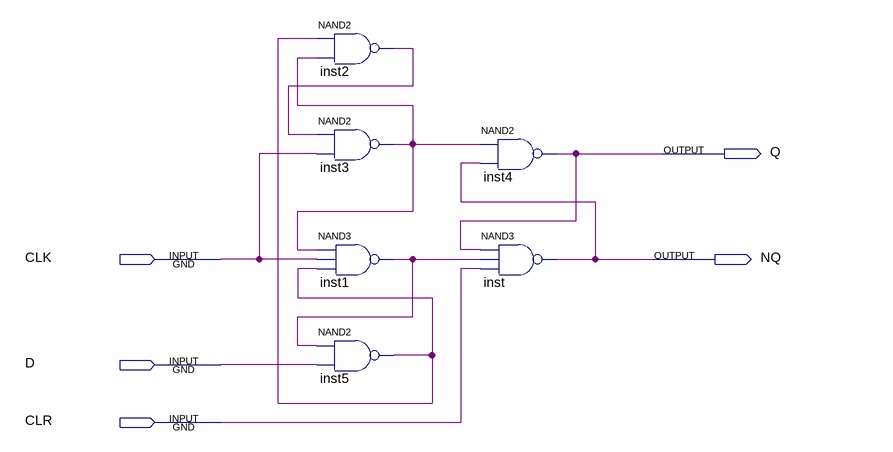
[diagram p0: schematic sheet]
// Quartus schematic DFF_Edge_Trigger.bdf as structural Verilog: 6 symbols, 5 pins
module DFF_Edge_Trigger (
  input  CLK,
  input  D,
  input  CLR,
  output Q,
  output NQ
);

  wire inst1_out, inst2_out, inst3_out, inst5_out;

  nand inst2 (inst2_out, inst5_out, inst3_out);
  nand inst3 (inst3_out, inst2_out, CLK);
  nand inst1 (inst1_out, inst3_out, CLK, inst5_out);
  nand inst5 (inst5_out, inst1_out, D);
  nand inst4 (Q, inst3_out, NQ);
  nand inst (NQ, Q, inst1_out, CLR);
endmodule
